# EAGLE design SmartMDC03 (EAGLE 7.5.0)
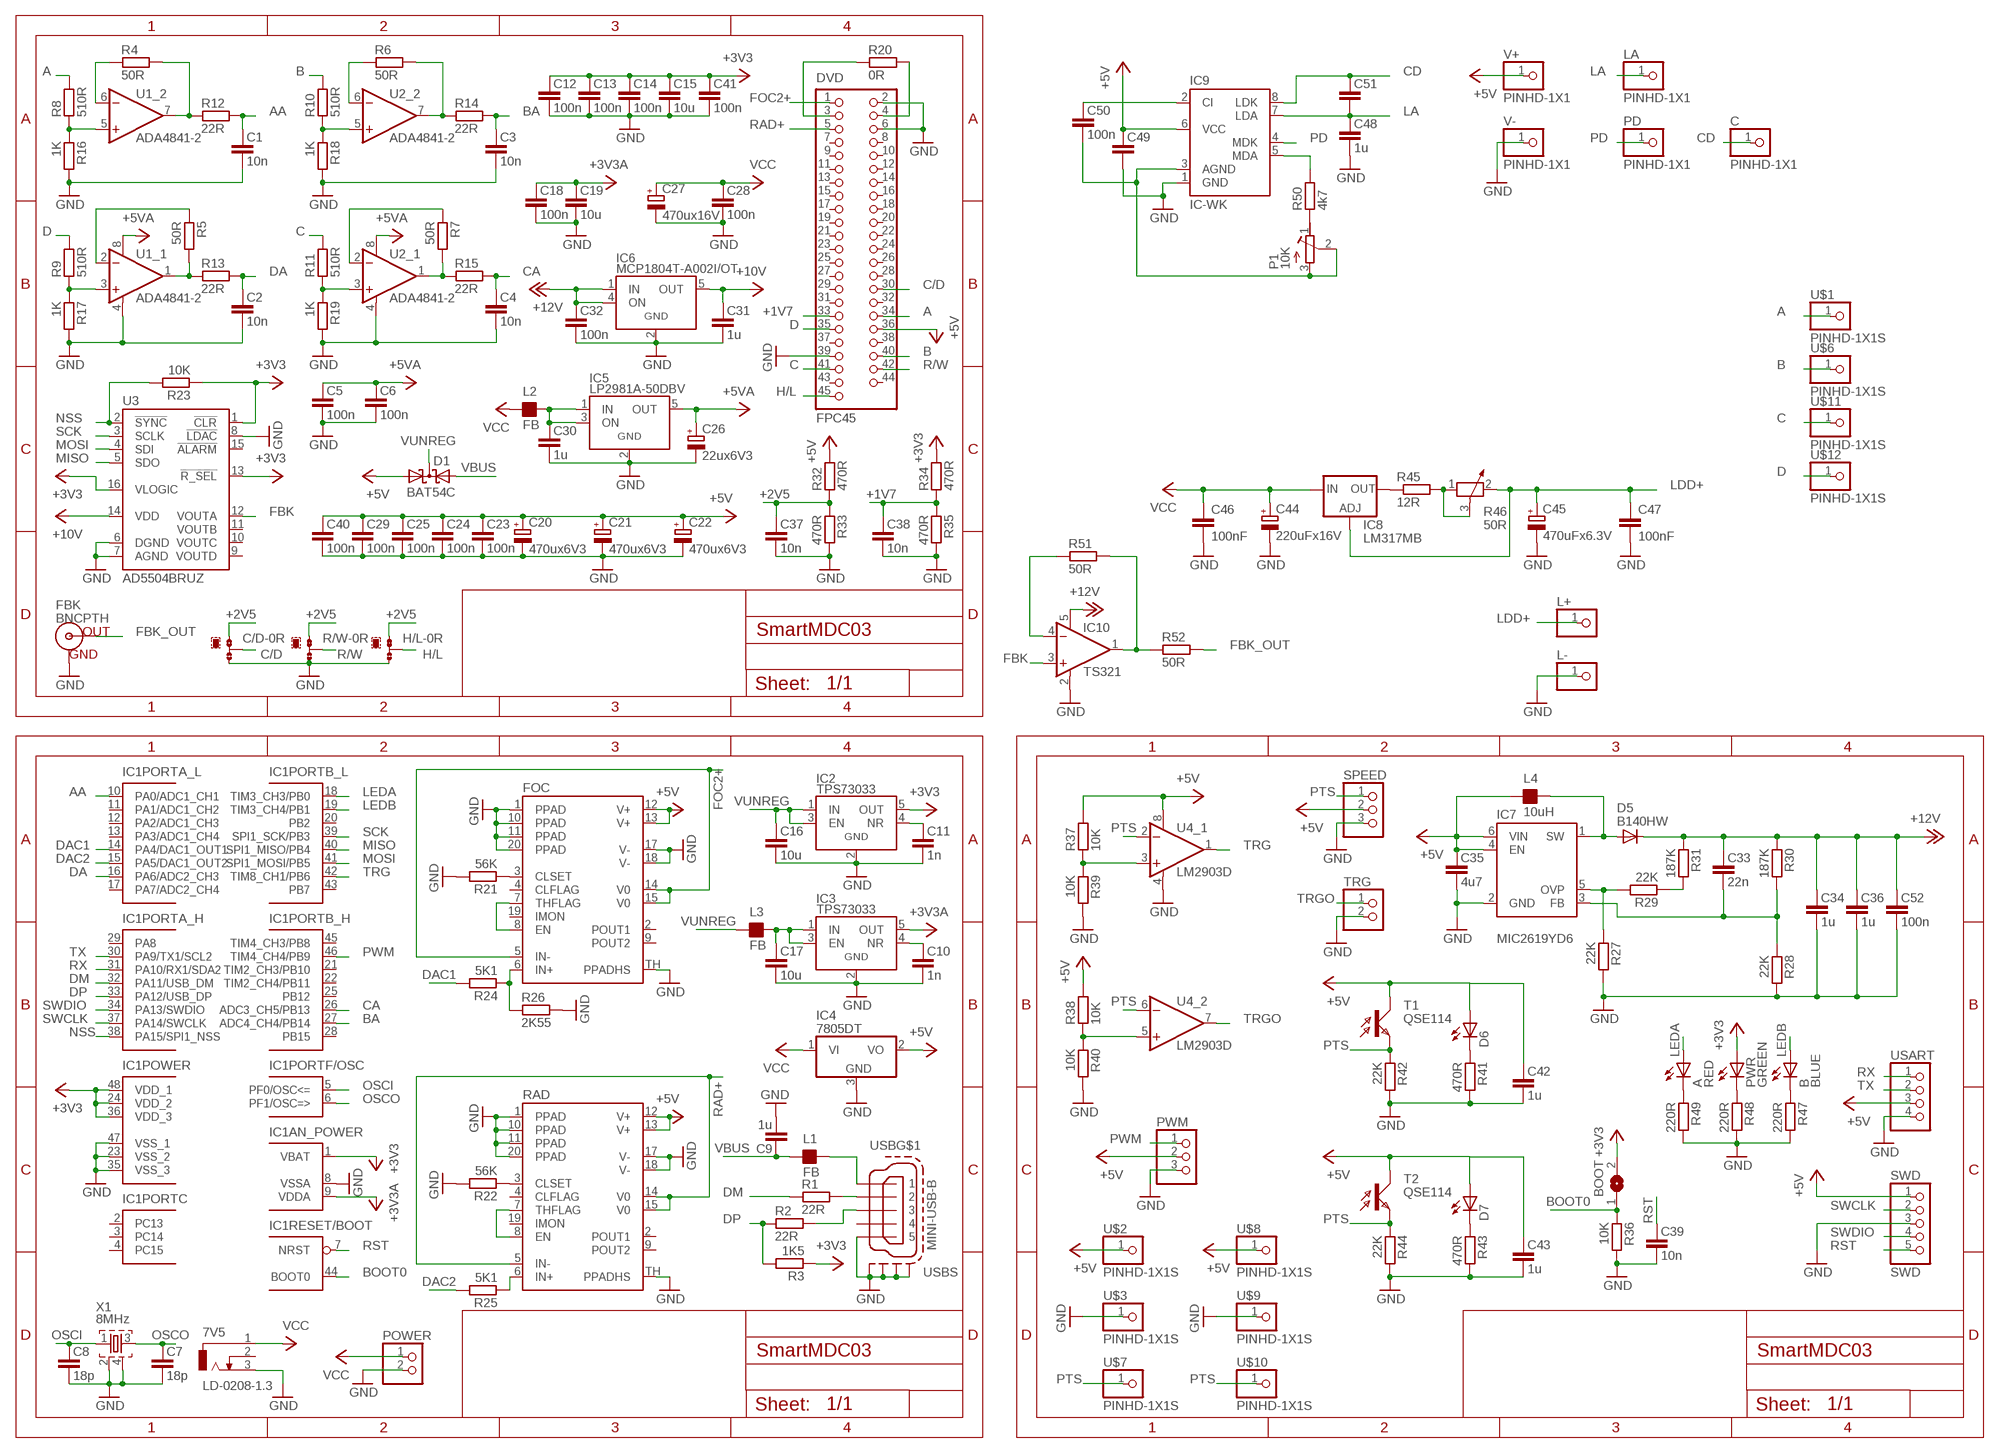
[diagram p0: schematic, sheet 1]

## Parts
7V5  LD-0208-1.3  [LD-0208]
A  RED  LEDCHIPLED_0805  [CHIPLED_0805]
B  BLUE  LEDCHIPLED_0805  [CHIPLED_0805]
BOOT  SJ  [SJ]
C  PINHD-1X1  [1X01]
C1  10n  C_EU_C0603G  [C0603G]
C2  10n  C_EU_C0603G  [C0603G]
C3  10n  C_EU_C0603G  [C0603G]
C4  10n  C_EU_C0603G  [C0603G]
C5  100n  C_EU_C0603G  [C0603G]
C6  100n  C_EU_C0603G  [C0603G]
C7  18p  C_EU_C0603G  [C0603G]
C8  18p  C_EU_C0603G  [C0603G]
C9  1u  C_EU_C0603G  [C0603G]
C10  1n  C_EU_C0603G  [C0603G]
C11  1n  C_EU_C0603G  [C0603G]
C12  100n  C_EU_C0603G  [C0603G]
C13  100n  C_EU_C0603G  [C0603G]
C14  100n  C_EU_C0603G  [C0603G]
C15  10u  C_EU_C0805G  [C0805G]
C16  10u  C_EU_C0805G  [C0805G]
C17  10u  C_EU_C0805G  [C0805G]
C18  100n  C_EU_C0603G  [C0603G]
C19  10u  C_EU_C0805G  [C0805G]
C20  470ux6V3  CPOL-EUSMCD  [SMC_D]
C21  470ux6V3  CPOL-EUSMCD  [SMC_D]
C22  470ux6V3  CPOL-EUSMCD  [SMC_D]
C23  100n  C_EU_C0603G  [C0603G]
C24  100n  C_EU_C0603G  [C0603G]
C25  100n  C_EU_C0603G  [C0603G]
C26  22ux6V3  CPOL-EUSMCA  [SMC_A]
C27  470ux16V  CPOL-EUE2.5-7  [E2,5-7]
C28  100n  C_EU_C0603G  [C0603G]
C29  100n  C_EU_C0603G  [C0603G]
C30  1u  C_EU_C0603G  [C0603G]
C31  1u  C_EU_C0603G  [C0603G]
C32  100n  C_EU_C0603G  [C0603G]
C33  22n  C_EU_C0603  [C0603]
C34  1u  C_EU_C0603G  [C0603G]
C35  4u7  C_EU_C0603G  [C0603G]
C36  1u  C_EU_C0603G  [C0603G]
C37  10n  C_EU_C0603G  [C0603G]
C38  10n  C_EU_C0603G  [C0603G]
C39  10n  C_EU_C0603G  [C0603G]
C40  100n  C_EU_C0603G  [C0603G]
C41  100n  C_EU_C0603G  [C0603G]
C42  1u  C_EU_C0603G  [C0603G]
C43  1u  C_EU_C0603G  [C0603G]
C44  220uFx16V  CPOL-EUE3.5-8  [E3,5-8]
C45  470uFx6.3V  CPOL-EUE3.5-8  [E3,5-8]
C46  100nF  C-EU050-024X044  [C050-024X044]
C47  100nF  C-EU050-024X044  [C050-024X044]
C48  1u  C_EU_C0805  [C0805]
C49  C_EU_C0805  [C0805]
C50  100n  C_EU_C0805  [C0805]
C51  C_EU_C0805  [C0805]
C52  100n  C_EU_C0603G  [C0603G]
C/D  0R-JUMPA  [A0R-JMP]
D1  BAT54C  [SOT23]
D5  B140HW  [SOD123]
D6  OP240  [OP240]
D7  OP240  [OP240]
DVD  FPC45  CON-FPC45  [FPC45]
FBK  BNCPTH  [BNC]
FOC  OPA569  [SO-20]
H/L  0R-JUMPA  [A0R-JMP]
IC1  STM32F303CXT6  [LQFP48]
IC2  TPS73033  TPS769XX  [SOT23-5]
IC3  TPS73033  TPS769XX  [SOT23-5]
IC4  7805DT  [TO252]
IC5  LP2981A-50DBV  [SOT23-5]
IC6  MCP1804T-A002I/OT  [SOT23-5]
IC7  MIC2619YD6  [SOT23-6]
IC8  LM317MB  [TO220L1]
IC9  IC-WK  [SOIC-8]
IC10  TS321  [SOT23-5]
L1  FB  FB_0603  [L0603]
L2  FB  FB_0603  [L0603]
L3  FB  FB_0603  [L0603]
L4  10uH  FB_1210  [L1210]
L+  PINHD-1X1  [1X01]
L-  PINHD-1X1  [1X01]
LA  PINHD-1X1  [1X01]
P1  10K  R-TRIMM3165W  [RTRIM3165W]
PD  PINHD-1X1  [1X01]
POWER  PINHD-1X2  [1X02]
PWM  PINHD-1X3  [1X03]
PWR  GREEN  LEDCHIPLED_0805  [CHIPLED_0805]
R1  22R  R_EU_R0603  [R0603]
R2  22R  R_EU_R0603  [R0603]
R3  1K5  R_EU_R0603  [R0603]
R4  50R  R_EU_R0603  [R0603]
R5  50R  R_EU_R0603  [R0603]
R6  50R  R_EU_R0603  [R0603]
R7  50R  R_EU_R0603  [R0603]
R8  510R  R_EU_R0603  [R0603]
R9  510R  R_EU_R0603  [R0603]
R10  510R  R_EU_R0603  [R0603]
R11  510R  R_EU_R0603  [R0603]
R12  22R  R_EU_R0603  [R0603]
R13  22R  R_EU_R0603  [R0603]
R14  22R  R_EU_R0603  [R0603]
R15  22R  R_EU_R0603  [R0603]
R16  1K  R_EU_R0603G  [R0603G]
R17  1K  R_EU_R0603G  [R0603G]
R18  1K  R_EU_R0603G  [R0603G]
R19  1K  R_EU_R0603G  [R0603G]
R20  0R  R_EU_R0603  [R0603]
R21  56K  R_EU_R0603G  [R0603G]
R22  56K  R_EU_R0603G  [R0603G]
R23  10K  R_EU_R0603  [R0603]
R24  5K1  R_EU_R0603  [R0603]
R25  5K1  R_EU_R0603  [R0603]
R26  2K55  R_EU_R0603G  [R0603G]
R27  22K  R_EU_R0603G  [R0603G]
R28  22K  R_EU_R0603G  [R0603G]
R29  22K  R_EU_R0603  [R0603]
R30  187K  R_EU_R0603  [R0603]
R31  187K  R_EU_R0603  [R0603]
R32  470R  R_EU_R0603  [R0603]
R33  470R  R_EU_R0603G  [R0603G]
R34  470R  R_EU_R0603  [R0603]
R35  470R  R_EU_R0603G  [R0603G]
R36  10K  R_EU_R0603G  [R0603G]
R37  10K  R_EU_R0603  [R0603]
R38  10K  R_EU_R0603  [R0603]
R39  10K  R_EU_R0603G  [R0603G]
R40  10K  R_EU_R0603G  [R0603G]
R41  470R  R_EU_R0603G  [R0603G]
R42  22K  R_EU_R0603G  [R0603G]
R43  470R  R_EU_R0603G  [R0603G]
R44  22K  R_EU_R0603G  [R0603G]
R45  12R  R-EU_0207/7  [0207/7]
R46  50R  POTENTIOMETER_PT_SPIN  [PT-SPIN]
R47  220R  R_EU_R0603G  [R0603G]
R48  220R  R_EU_R0603G  [R0603G]
R49  220R  R_EU_R0603G  [R0603G]
R50  4k7  R_EU_R0805  [R0805]
R51  50R  R_EU_R0603  [R0603]
R52  50R  R_EU_R0603  [R0603]
R/W  0R-JUMPA  [A0R-JMP]
RAD  OPA569  [SO-20]
SPEED  PINHD-1X3  [1X03]
SWD  SWD  PINHD-1X5  [1X05]
T1  QSE114  [QSE114]
T2  QSE114  [QSE114]
TRG  PINHD-1X2  [1X02]
U1  ADA4841-2  [SOIC-8]
U2  ADA4841-2  [SOIC-8]
U3  AD5504BRUZ  [TSSOP16]
U4  LM2903D  [SOIC-8]
U$1  PINHD-1X1S  [1X01S]
U$2  PINHD-1X1S  [1X01S]
U$3  PINHD-1X1S  [1X01S]
U$6  PINHD-1X1S  [1X01S]
U$7  PINHD-1X1S  [1X01S]
U$8  PINHD-1X1S  [1X01S]
U$9  PINHD-1X1S  [1X01S]
U$10  PINHD-1X1S  [1X01S]
U$11  PINHD-1X1S  [1X01S]
U$12  PINHD-1X1S  [1X01S]
USART  PINHD-1X4  [1X04]
USB  MINI-USB-B  MINI-USB-SCHIELD-32005-201  [32005-201]
V+  PINHD-1X1  [1X01]
V-  PINHD-1X1  [1X01]
X1  8MHz  ABMM2  [ABMM2]

## Nets
+1V7: C38.1 DVD.33 R34.1 R35.1
+2V5: C37.1 C/D.1 H/L.1 R32.1 R33.1 R/W.1
+3V3: BOOT.2 C12.1 C13.1 C14.1 C15.1 C41.1 IC1.1(AN_POWER:VBAT) IC1.24(POWER:VDD_2) IC1.36(POWER:VDD_3) IC1.48(POWER:VDD_1) IC2.5(OUT) PWR.A R3.1 R23.1 R34.2 U3.1(!CLR) U3.13(!R_SEL) U3.16(VLOGIC)
+3V3A: C18.1 C19.1 IC1.9(AN_POWER:VDDA) IC3.5(OUT)
+5V: C20.+ C21.+ C22.+ C23.1 C24.1 C25.1 C29.1 C35.1 C40.1 C42.1 C43.1 C49.1 D1.1(A1) D6.A D7.A DVD.36 FOC.12(V+) FOC.13(V+) IC4.2(VO) IC7.4(EN) IC7.6(VIN) IC9.6(VCC) L4.1 PWM.2 R32.2 R37.2 R38.2 RAD.12(V+) RAD.13(V+) SPEED.2 SWD.1 T1.C T2.C U4.8(_1:V+) U$2.1 U$8.1 USART.3 V+.1
+5VA: C5.1 C6.1 C26.+ IC5.5(OUT) U1.8(_1:V+) U2.8(_1:V+)
+10V: C31.1 IC6.5(OUT) U3.14(VDD)
+12V: C32.1 C33.1 C34.1 C36.1 C52.1 D5.C IC6.1(IN) IC6.4(ON) IC10.5(V+) R30.1 R31.1
A: DVD.34 R8.2 U$1.1
AA: C1.1 IC1.10(PORTA_L:PA0/ADC1_CH1) R12.2
B: DVD.40 R10.2 U$6.1
BA: C3.1 IC1.27(PORTB_H:ADC4_CH4/PB14) R14.2
BOOT0: BOOT.1 IC1.44(RESET/BOOT:BOOT0) R36.1
C: DVD.41 R11.2 U$11.1
C/D: C/D.2 DVD.30
CA: C4.1 IC1.26(PORTB_H:ADC3_CH5/PB13) R15.2
CD: C51.1 C.1 IC9.8(LDK)
D: DVD.35 R9.2 U$12.1
DA: C2.1 IC1.16(PORTA_L:PA6/ADC2_CH3) R13.2
DAC1: IC1.14(PORTA_L:PA4/DAC1_OUT1) R24.2
DAC2: IC1.15(PORTA_L:PA5/DAC1_OUT2) R25.2
DM: IC1.32(PORTA_H:PA11/USB_DM) R1.1
DP: IC1.33(PORTA_H:PA12/USB_DP) R2.1 R3.2
FBK: IC10.3(+IN) U3.12(VOUTA)
FBK_OUT: FBK.S(OUT) R52.2
FOC2+: DVD.1 FOC.5(IN-) FOC.14(V0) FOC.15(V0)
GND: 7V5.3 C1.2 C2.2 C3.2 C4.2 C5.2 C6.2 C7.2 C8.2 C9.2 C10.2 C11.2 C12.2 C13.2 C14.2 C15.2 C16.2 C17.2 C18.2 C19.2 C20.- C21.- C22.- C23.2 C24.2 C25.2 C26.- C27.- C28.2 C29.2 C30.2 C31.2 C32.2 C34.2 C35.2 C36.2 C37.2 C38.2 C39.2 C40.2 C41.2 C42.2 C43.2 C44.- C45.- C46.2 C47.2 C48.2 C49.2 C52.2 C/D.3 DVD.2 DVD.6 DVD.39 FBK.GND FOC.1(PPAD) FOC.10(PPAD) FOC.11(PPAD) FOC.17(V-) FOC.18(V-) FOC.20(PPAD) FOC.TH(PPADHS) H/L.3 IC1.8(AN_POWER:VSSA) IC1.23(POWER:VSS_2) IC1.35(POWER:VSS_3) IC1.47(POWER:VSS_1) IC2.2(GND) IC3.2(GND) IC4.3(GND) IC5.2(GND) IC6.2(GND) IC7.2(GND) IC9.1(GND) IC10.2(V-) L-.1 POWER.2 PWM.3 R16.2 R17.2 R18.2 R19.2 R21.2 R22.2 R26.2 R27.2 R28.2 R33.2 R35.2 R36.2 R39.2 R40.2 R41.2 R42.2 R43.2 R44.2 R47.2 R48.2 R49.2 R/W.3 RAD.1(PPAD) RAD.10(PPAD) RAD.11(PPAD) RAD.17(V-) RAD.18(V-) RAD.20(PPAD) RAD.TH(PPADHS) SPEED.3 SWD.3 TRG.2 U1.4(_1:V-) U2.4(_1:V-) U3.6(DGND) U3.7(AGND) U3.8(!LDAC) U4.4(_1:V-) U$3.1 U$9.1 USART.4 USB.5 USB.M1(S:S1) USB.M2(S:S2) USB.M3(S:S3) USB.M4(S:S4) V-.1 X1.2 X1.4
H/L: DVD.45 H/L.2
LA: C48.1 C51.2 IC9.7(LDA) LA.1
LDD+: C45.+ C47.1 IC8.1(ADJ) L+.1 R46.2
LEDA: A.A IC1.18(PORTB_L:TIM3_CH3/PB0)
LEDB: B.A IC1.19(PORTB_L:TIM3_CH4/PB1)
MISO: IC1.40(PORTB_L:SPI1_MISO/PB4) U3.5(SDO)
MOSI: IC1.41(PORTB_L:SPI1_MOSI/PB5) U3.4(SDI)
N$1: C11.1 IC2.4(NR)
N$2: R9.1 R17.1 U1.3(_1:+IN)
N$3: R11.1 R19.1 U2.3(_1:+IN)
N$4: R10.1 R18.1 U2.5(_2:+IN)
N$5: R4.2 R12.1 U1.7(_2:OUT)
N$6: R5.2 R13.1 U1.1(_1:OUT)
N$7: R6.2 R14.1 U2.7(_2:OUT)
N$8: R7.2 R15.1 U2.1(_1:OUT)
N$9: D7.C R43.1
N$10: R25.1 RAD.6(IN+)
N$11: FOC.6(IN+) R24.1 R26.1
N$12: C10.1 IC3.4(NR)
N$13: R4.1 U1.6(_2:-IN)
N$14: R6.1 U2.6(_2:-IN)
N$15: R7.1 U2.2(_1:-IN)
N$16: R5.1 U1.2(_1:-IN)
N$17: R8.1 R16.1 U1.5(_2:+IN)
N$18: D6.C R41.1
N$19: C30.1 IC5.1(IN) IC5.3(ON) L2.2
N$20: R1.2 USB.2
N$21: R2.2 USB.3
N$22: C17.1 IC3.1(IN) IC3.3(EN) L3.2
N$23: DVD.4 R20.2
N$24: DVD.3 R20.1
N$25: L1.2 USB.1
N$26: IC8.2(OUT) R45.1
N$27: R45.2 R46.1 R46.3
N$28: R37.1 R39.1 U4.3(_1:+IN)
N$29: B.C R47.1
N$30: FOC.3(CLSET) R21.1
N$31: R22.1 RAD.3(CLSET)
N$32: R38.1 R40.1 U4.5(_2:+IN)
N$33: FOC.7(THFLAG) FOC.8(EN)
N$34: R29.1 R31.2
N$35: RAD.7(THFLAG) RAD.8(EN)
N$36: IC7.5(OVP) R27.1 R29.2
N$37: C33.2 IC7.3(FB) R28.1 R30.2
N$38: PWR.C R48.1
N$39: A.C R49.1
N$40: P1.1(A) R50.1
N$41: IC10.4(-IN) R51.1
N$42: C50.1 IC9.2(CI)
N$43: IC10.1(OUT) R51.2 R52.1
N$44: IC9.5(MDA) R50.2
N$45: C50.2 IC9.3(AGND) P1.2(S) P1.3(E)
NSS: IC1.38(PORTA_H:PA15/SPI1_NSS) R23.2 U3.2(!SYNC)
OSCI: C8.1 IC1.5(PORTF/OSC:PF0/OSC<=) X1.1
OSCO: C7.1 IC1.6(PORTF/OSC:PF1/OSC=>) X1.3
PD: IC9.4(MDK) PD.1
PTS: R42.1 R44.1 SPEED.1 T1.E T2.E U4.2(_1:-IN) U4.6(_2:-IN) U$7.1 U$10.1
PWM: IC1.46(PORTB_H:TIM4_CH4/PB9) PWM.1
R/W: DVD.42 R/W.2
RAD+: DVD.5 RAD.5(IN-) RAD.14(V0) RAD.15(V0)
RST: C39.1 IC1.7(RESET/BOOT:NRST) SWD.5
RX: IC1.31(PORTA_H:PA10/RX1/SDA2) USART.1
SCK: IC1.39(PORTB_L:SPI1_SCK/PB3) U3.3(SCLK)
SW: D5.A IC7.1(SW) L4.2
SWCLK: IC1.37(PORTA_H:PA14/SWCLK) SWD.2
SWDIO: IC1.34(PORTA_H:PA13/SWDIO) SWD.4
TRG: IC1.42(PORTB_L:TIM8_CH1/PB6) U4.1(_1:OUT)
TRGO: TRG.1 U4.7(_2:OUT)
TX: IC1.30(PORTA_H:PA9/TX1/SCL2) USART.2
VBUS: C9.1 D1.2(A2) L1.1
VCC: 7V5.1 C27.+ C28.1 C44.+ C46.1 IC4.1(VI) IC8.3(IN) L2.1 POWER.1
VUNREG: C16.1 D1.3(CC) IC2.1(IN) IC2.3(EN) L3.1
Unconnected: 7V5.2 DVD.7 DVD.8 DVD.9 DVD.10 DVD.11 DVD.12 DVD.13 DVD.14 DVD.15 DVD.16 DVD.17 DVD.18 DVD.19 DVD.20 DVD.21 DVD.22 DVD.23 DVD.24 DVD.25 DVD.26 DVD.27 DVD.28 DVD.29 DVD.31 DVD.32 DVD.37 DVD.38 DVD.43 DVD.44 FOC.2(POUT1) FOC.4(CLFLAG) FOC.9(POUT2) FOC.19(IMON) IC1.2(PORTC:PC13) IC1.3(PORTC:PC14) IC1.4(PORTC:PC15) IC1.11(PORTA_L:PA1/ADC1_CH2) IC1.12(PORTA_L:PA2/ADC1_CH3) IC1.13(PORTA_L:PA3/ADC1_CH4) IC1.17(PORTA_L:PA7/ADC2_CH4) IC1.20(PORTB_L:PB2) IC1.21(PORTB_H:TIM2_CH3/PB10) IC1.22(PORTB_H:TIM2_CH4/PB11) IC1.25(PORTB_H:PB12) IC1.28(PORTB_H:PB15) IC1.29(PORTA_H:PA8) IC1.43(PORTB_L:PB7) IC1.45(PORTB_H:TIM4_CH3/PB8) RAD.2(POUT1) RAD.4(CLFLAG) RAD.9(POUT2) RAD.19(IMON) U3.9(VOUTD) U3.10(VOUTC) U3.11(VOUTB) U3.15(!ALARM) USB.4

## Library data of the parts
7V5 = SmartMDC:LD-0208: Straight PCB Mount DC Power Socket 1A, 12 V dc, Nickel Plated
A B PWR = SmartMDC:LED
BOOT = SmartMDC:SJ: SMD solder JUMPER
C LA PD U$1-U$3 U$6-U$12 V+ V- = SmartMDC:PINHD-1X1
C1-C14 C18 C23-C25 C28-C43 C48-C52 = SmartMDC:C_EU_
C15-C17 C19 = svBGC:C_EU_
C20-C22 C26 C27 = SmartMDC:CPOL-EU: POLARIZED CAPACITOR, European symbol
C44 C45 = rcl:CPOL-EU: POLARIZED CAPACITOR, European symbol
C46 C47 = rcl:C-EU: CAPACITOR, European symbol
C/D H/L R/W = jump-0r-smd:0R-JUMP: SMD 0R 0805 Jumper
D1 = SmartMDC:BAT54C: Schottky Diodes Source: Fairchild .. BAT54.pdf
D5 = SmartMDC:B140HW: 1.0A SURFACE MOUNT SCHOTTKY BARRIER RECTIFIER
D6 D7 = SmartMDC:OP240: GaAlAs Plastic Infrared Emitting Diode
DVD = SmartMDC:CON-FPC
FBK = SmartMDC:BNC: BNC Connector, Mouser Part# 5227161
FOC RAD = SmartMDC:OPA569: Burr Brown products from Texas Instruments Rail-to-Rail I/O, 2A POWER AMPLIFIER
IC1 = SmartMDC:STM32F303CXT6: ST STM32F101/103 48pin LQFP
IC2 IC3 = SmartMDC:TPS769XX: Texas Instruments LDO Regulator
IC4 = linear:78*: Positive VOLTAGE REGULATOR Source: http://cache.national.com/ds/LM/LM78L05.pdf http://www.fairchildsemi.com/ds/LM/LM7805.pdf
IC5 = SmartMDC:LP2981A: TEXAS INSTRUMENTS 100-mA ULTRA-LOW DROPOUT REGULATOR WITH SHUTDOWN
IC6 = SmartMDC:MCP1804T
IC7 = SmartMDC:MIC2619
IC8 = v-reg:LM317?*: 500 mA Adjustable Output Positive Voltage Regulator Source: http://www.onsemi.co.jp .. LM317M-D.PDF
IC9 = SmartMDC:IC-WK
IC10 = SmartMDC:TS321
L1-L4 = SmartMDC:FB_: FERRITE BEAD
L+ L- = pinhead:PINHD-1X1: PIN HEADER
P1 = SmartMDC:R-TRIMM
POWER TRG = SmartMDC:PINHD-1X2: PIN HEADER
PWM SPEED = SmartMDC:PINHD-1X3: PIN HEADER
R1-R44 R47-R52 = SmartMDC:R_EU_
R45 = rcl:R-EU_: RESISTOR, European symbol
R46 = rcl:POTENTIOMETER_: Potentiometer
SWD = SmartMDC:PINHD-1X5: PIN HEADER
T1 T2 = SmartMDC:QSE114: PLASTIC SILICON INFRARED PHOTOTRANSISTOR
U1 U2 = SmartMDC:ADA4841
U3 = SmartMDC:AD5504: ANALOG DEVICES High Voltage, Quad-Channel 12-Bit Voltage Output DAC
U4 = SmartMDC:LM2903: COMPARATOR
USART = SmartMDC:PINHD-1X4: PIN HEADER
USB = SmartMDC:MINI-USB-SCHIELD-: MINI USB-B Conector Source: www.cypressindustries.com; OC_FARNELL: unknown; OC_NEWARK: unknown
X1 = SmartMDC:ABM

## Board
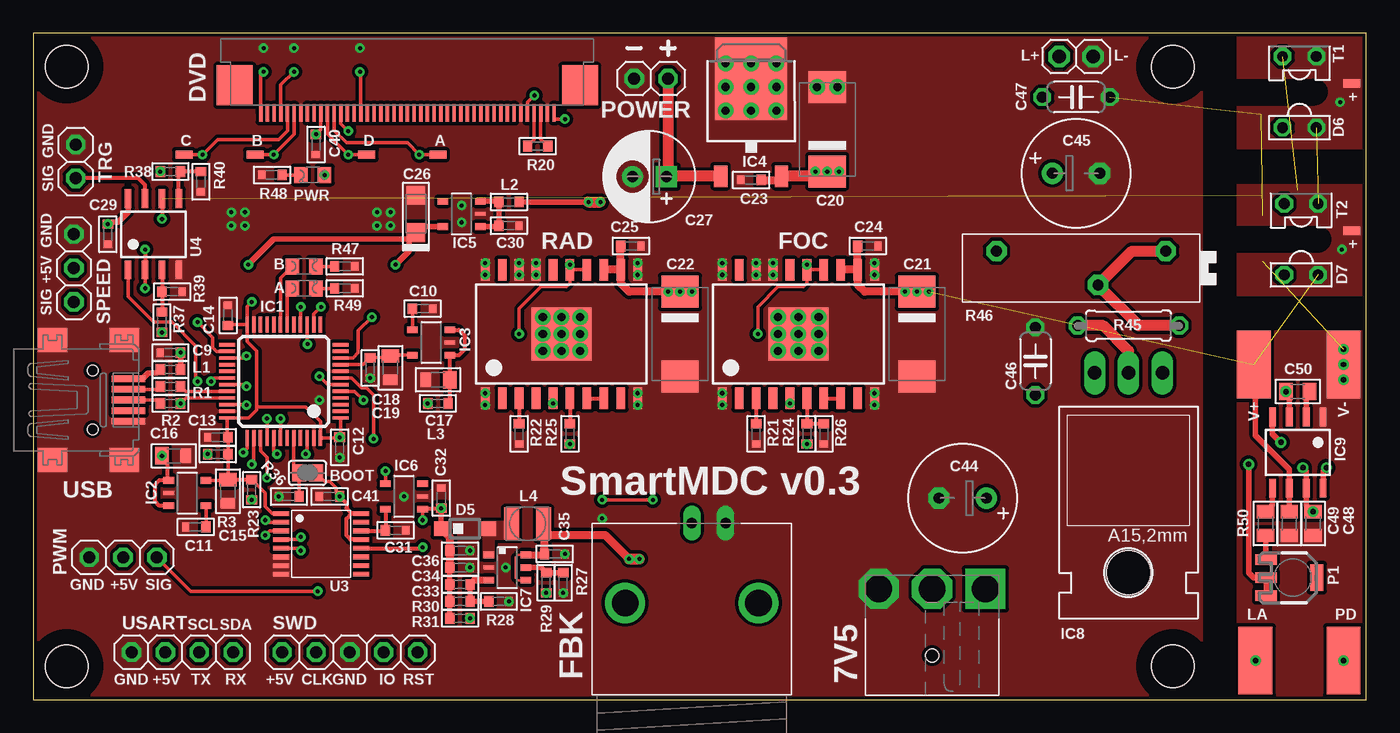
[diagram p1: board, top side]
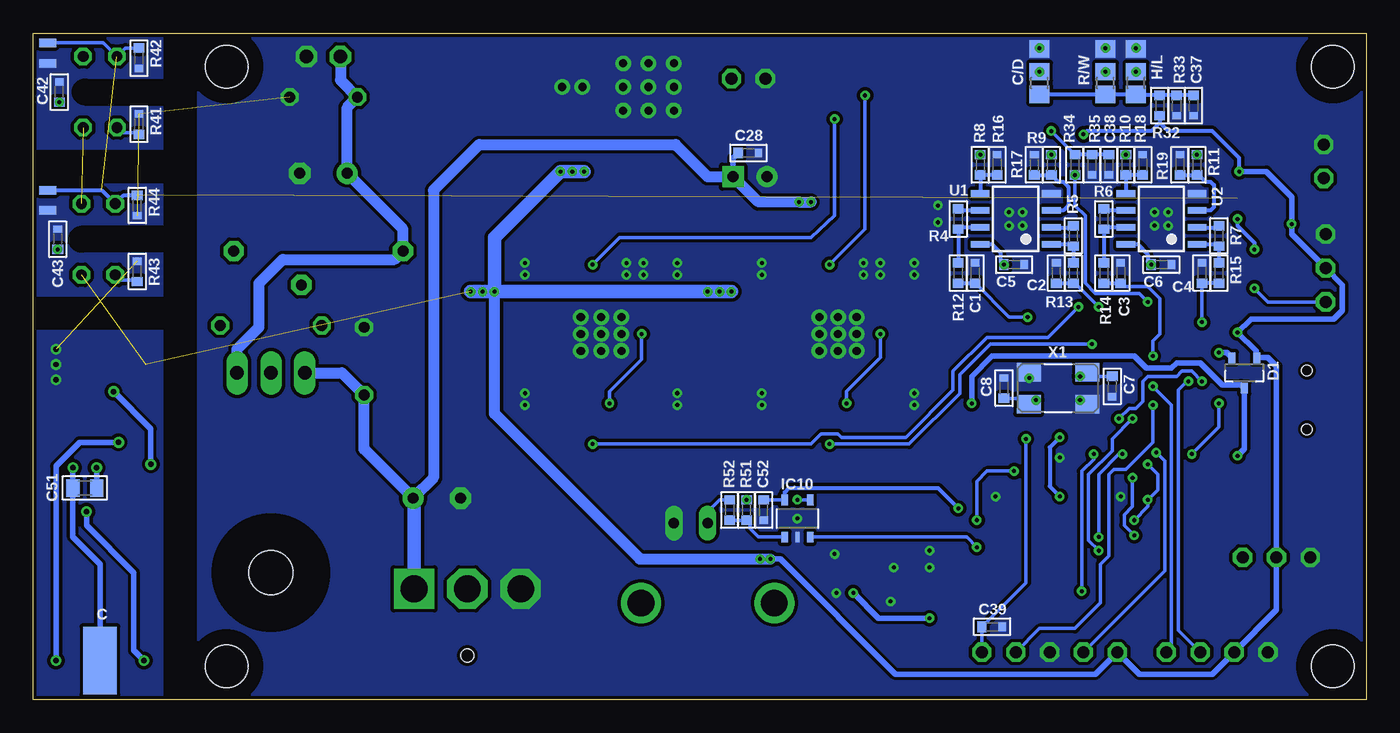
[diagram p2: board, bottom side, seen from below]

Size 100 x 50 mm. Coordinates in mm from the lower left corner, seen from the top.
Outline: 0,0 100,0 100,50 0,50 0,0
Copper layers (1*16): Top 0.035mm / dielectric 1.5mm / Bottom 0.035mm
Design rules "default *": minimum track width 8mil, minimum drill 12mil, track to track 8mil, track to pad 8mil, pad to pad 8mil, via to via 8mil, smd to smd 0mil, copper to edge 10mil, drill to drill 8mil, minimum pad ring 10mil, minimum via ring 8mil, stop-mask expansion 4mil, vias tented up to drill 16mil, thermal gap 10mil
Holes 3.2 mm at 2.5,2.5 2.5,47.5 85.5,47.5 85.5,2.5
tRestrict: area 0,0 to 5,5; area 0,45 to 5,50; area 83,45 to 88,50; area 83,0 to 88,5; area 90,28 to 100,30; area 90,39 to 100,41; 3 lines
bRestrict: area 0,45 to 5,50; area 0,0 to 5,5; area 83,0 to 88,5; area 83,45 to 88,50; area 90,39 to 100,41; area 90,39 to 100,41; area 90,28 to 100,30; 3 lines

### Footprints (pad centres in the part's own frame; a part is rotated, then mirrored left to right if it is on the bottom)
LD-0208 = drill 2 square: 1 4,5 | drill 2 octagon: 2 0,5; 3 -4,5 | hole 1: 0,0
CHIPLED_0805 = smd 1.2 x 1: A 0,-0.889; C 0,0.889
SJ = smd 1.067 x 1.27: 1 -0.635,0; 2 0.635,0
1X01 = smd 2.54 x 5.08: 1 0,0
C0603G = smd 0.7 x 0.8: 1 -0.762,0 | smd 0.548 x 0.648: 2 0.762,0
C0805G = smd 1 x 1.3: 1 -0.889,0 | smd 0.797 x 1.097: 2 0.889,0
SMC_D = smd 2.4 x 2.8: + -3.175,0; - 3.175,0
SMC_A = smd 1.4 x 1.4: + -1.4,0; - 1.4,0
E2,5-7 = drill 0.813 pad 1.6 square: + -1.27,0 | drill 0.813 pad 1.6: - 1.27,0
C0603 = smd 0.7 x 0.8: 1 -0.762,0; 2 0.762,0
E3,5-8 = drill 0.813 pad 1.6: + -1.778,0 | drill 0.813 pad 1.6 octagon: - 1.778,0
C050-024X044 = drill 0.813 octagon: 1 -2.54,0; 2 2.54,0
C0805 = smd 1 x 1.3: 1 -0.889,0; 2 0.889,0
A0R-JMP = smd 1.5 x 1.3: 1 0,1.7; 2 0,0; 3 0,-1.7
SOT23 = smd 0.55 x 0.8: 1 -0.94,-1.143; 2 0.94,-1.143; 3 0,1.143
SOD123 = smd 1.1 x 1.1: A 1.778,0; C -1.778,0
OP240 = drill 0.813 octagon: A 0,-1.27; C 0,1.27
FPC45 = smd 0.25 x 1.3: 1 -11,3.1; 2 -10.5,3.1; 3 -10,3.1; 4 -9.5,3.1; 5 -9,3.1; 6 -8.5,3.1; 7 -8,3.1; 8 -7.5,3.1; 9 -7,3.1; 10 -6.5,3.1; 11 -6,3.1; 12 -5.5,3.1; 13 -5,3.1; 14 -4.5,3.1; 15 -4,3.1; 16 -3.5,3.1; 17 -3,3.1; 18 -2.5,3.1; 19 -2,3.1; 20 -1.5,3.1; 21 -1,3.1; 22 -0.5,3.1; 23 0,3.1; 24 0.5,3.1; 25 1,3.1; 26 1.5,3.1; 27 2,3.1; 28 2.5,3.1; 29 3,3.1; 30 3.5,3.1; 31 4,3.1; 32 4.5,3.1; 33 5,3.1; 34 5.5,3.1; 35 6,3.1; 36 6.5,3.1; 37 7,3.1; 38 7.5,3.1; 39 8,3.1; 40 8.5,3.1; 41 9,3.1; 42 9.5,3.1; 43 10,3.1; 44 10.5,3.1; 45 11,3.1 | smd 2.7 x 3: S$1 -12.95,1.02; S$2 12.95,1.02
BNC = drill 2: 3 -5,0; 4 5,0 | drill 0.8 long: GND -2.54,-6; S 0,-6
SO-20 = smd 0.65 x 1.6: 1 -5.715,-4.826; 2 -4.445,-4.826; 3 -3.175,-4.826; 4 -1.905,-4.826; 5 -0.635,-4.826; 6 0.635,-4.826; 7 1.905,-4.826; 8 3.175,-4.826; 9 4.445,-4.826; 10 5.715,-4.826; 11 5.715,4.826; 12 4.445,4.826; 13 3.175,4.826; 14 1.905,4.826; 15 0.635,4.826; 16 -0.635,4.826; 17 -1.905,4.826; 18 -3.175,4.826; 19 -4.445,4.826; 20 -5.715,4.826 | smd 4.5 x 4: TH 0,0
LQFP48 = smd 0.25 x 1.2: 1 -2.75,-4.25; 2 -2.25,-4.25; 3 -1.75,-4.25; 4 -1.25,-4.25; 5 -0.75,-4.25; 6 -0.25,-4.25; 7 0.25,-4.25; 8 0.75,-4.25; 9 1.25,-4.25; 10 1.75,-4.25; 11 2.25,-4.25; 12 2.75,-4.25; 25 2.75,4.25; 26 2.25,4.25; 27 1.75,4.25; 28 1.25,4.25; 29 0.75,4.25; 30 0.25,4.25; 31 -0.25,4.25; 32 -0.75,4.25; 33 -1.25,4.25; 34 -1.75,4.25; 35 -2.25,4.25; 36 -2.75,4.25 | smd 1.2 x 0.25: 13 4.25,-2.75; 14 4.25,-2.25; 15 4.25,-1.75; 16 4.25,-1.25; 17 4.25,-0.75; 18 4.25,-0.25; 19 4.25,0.25; 20 4.25,0.75; 21 4.25,1.25; 22 4.25,1.75; 23 4.25,2.25; 24 4.25,2.75; 37 -4.25,2.75; 38 -4.25,2.25; 39 -4.25,1.75; 40 -4.25,1.25; 41 -4.25,0.75; 42 -4.25,0.25; 43 -4.25,-0.25; 44 -4.25,-0.75; 45 -4.25,-1.25; 46 -4.25,-1.75; 47 -4.25,-2.25; 48 -4.25,-2.75
SOT23-5 = smd 0.5 x 0.8: 1 -0.95,-1.397; 3 0.95,-1.397; 4 0.95,1.397; 5 -0.95,1.397 | smd 0.297 x 0.8: 2 0,-1.397
TO252 = smd 1 x 1.6: 1 -2.28,-4.8; 2 2.28,-4.8 | smd 5.4 x 6.2: 3 0,2.5
SOT23-6 = smd 0.5 x 0.8: 1 -0.95,-1.397; 3 0.95,-1.397; 4 0.95,1.397; 5 0,1.397; 6 -0.95,1.397 | smd 0.297 x 0.8: 2 0,-1.397
TO220L1 = drill 1.016 long: 1 -2.54,-3.81; 2 0,-3.81; 3 2.54,-3.81 | hole 3.302: 0,11.176
SOIC-8 = smd 0.5 x 1.4: 1 -1.905,-2.667; 2 -0.635,-2.667; 3 0.635,-2.667; 4 1.905,-2.667; 5 1.905,2.667; 6 0.635,2.667; 7 -0.635,2.667; 8 -1.905,2.667
L0603 = smd 0.7 x 0.8: 1 -0.762,0; 2 0.762,0
L1210 = smd 1.1 x 2.4: 1 -1.2,0; 2 1.2,0
1X01' = drill 1.016 octagon: 1 0,0
RTRIM3165W = smd 0.8 x 1.6: 1 -1.35,-2; 2 0,-2; 3 1.35,-2 | smd 2 x 1: 4 0,1.8
1X02 = drill 0.9 octagon: 1 -1.27,0; 2 1.27,0
1X03 = drill 0.9 octagon: 1 -2.54,0; 2 0,0; 3 2.54,0
R0603 = smd 0.7 x 0.8: 1 -0.762,0; 2 0.762,0
R0603G = smd 0.7 x 0.8: 1 -0.762,0 | smd 0.548 x 0.648: 2 0.762,0
0207/7 = drill 0.813 octagon: 1 -3.81,0; 2 3.81,0
PT-SPIN = drill 0.813 pad 1.524 octagon: 1 -6.35,-1.27; 2 6.35,-1.27; 3 -1.27,1.27
R0805 = smd 1 x 1.3: 1 -0.889,0; 2 0.889,0
1X05 = drill 0.9 octagon: 1 -5.08,0; 2 -2.54,0; 3 0,0; 4 2.54,0; 5 5.08,0
QSE114 = drill 0.813 octagon: C 0,-1.27; E 0,1.27
TSSOP16 = smd 0.35 x 1.2: 1 -2.275,-3; 2 -1.625,-3; 3 -0.975,-3; 4 -0.325,-3; 5 0.325,-3; 6 0.975,-3; 7 1.625,-3; 8 2.275,-3; 9 2.275,3; 10 1.625,3; 11 0.975,3; 12 0.325,3; 13 -0.325,3; 14 -0.975,3; 15 -1.625,3; 16 -2.275,3
1X01S = smd 0.635 x 1.27: 1 0,0
1X04 = drill 0.9 octagon: 1 -3.81,0; 2 -1.27,0; 3 1.27,0; 4 3.81,0
32005-201 = smd 2.5 x 0.5: 1 2.7,1.6; 2 2.7,0.8; 3 2.7,0; 4 2.7,-0.8; 5 2.7,-1.6 | smd 2.2 x 1.8: M1 -3,-4.5; M2 -3,4.5; M3 2.4,4.5; M4 2.4,-4.5 | hole 0.8: 0,2.2; 0,-2.2
ABMM2 = smd 1.8 x 1.4: 1 -2.2,-1.2; 2 2.2,-1.2; 3 2.2,1.2; 4 -2.2,1.2

### Placement (x,y rotation side)
7V5  67.44,3.3 0 top
A  20.32,30.86 270 top
B  20.32,32.51 270 top
BOOT  20.57,17.02 0 top
C  95,2.92 0 bottom
C1  29.34,32 90 bottom
C2  23.24,32 90 bottom
C3  18.41,32 90 bottom
C4  12.32,32 90 bottom
C5  26.42,32.64 0 bottom
C6  15.37,32.64 0 bottom
C7  19.05,23.5 270 bottom
C8  27.18,23.37 90 bottom
C9  10.29,26.04 180 top
C10  29.21,29.34 0 top
C11  12.19,12.95 180 top
C12  22.99,18.92 270 top
C13  13.84,19.68 180 top
C14  14.61,28.83 90 top
C15  14.61,15.62 270 top
C16  10.54,18.29 0 top
C17  30.35,24 180 top
C18  25.27,24.89 270 top
C19  26.8,24.89 270 top
C20  59.56,42.8 90 top
C21  66.29,27.43 270 top
C22  48.51,27.43 270 top
C23  53.85,38.99 180 top
C24  62.61,34.04 0 top
C25  44.83,34.04 0 top
C26  28.7,36.45 90 top
C27  46.23,39.24 180 top
C28  46.35,41.02 0 bottom
C29  5.59,34.92 270 top
C30  35.69,35.56 0 top
C31  27.18,12.7 0 top
C32  30.61,15.11 90 top
C33  32,8.64 0 top
C34  32,9.91 0 top
C35  39.12,10.92 0 top
C36  32,11.18 0 top
C37  12.95,44.58 270 bottom
C38  19.3,40.13 270 bottom
C39  28.07,5.46 0 bottom
C40  21.21,41.66 270 top
C41  22.23,15.24 180 top
C42  98.04,45.59 90 bottom
C43  98.17,34.54 90 bottom
C44  69.72,15.11 180 top
C45  78.23,39.5 0 top
C46  75.18,25.4 90 top
C47  78.23,45.21 0 top
C48  96.01,13.21 270 top
C49  94.23,13.21 270 top
C50  94.87,23.11 180 top
C51  96.14,15.88 0 bottom
C52  45.21,14.22 270 bottom
C/D  24.51,47.12 180 bottom
D1  9.14,24.51 180 bottom
D5  32.38,12.83 0 top
D6  95,42.93 90 top
D7  95.12,31.88 90 top
DVD  28.07,47.12 180 top
FBK  49.4,7.24 180 top
FOC  57.4,27.43 0 top
H/L  17.27,47.12 180 bottom
IC1  18.8,23.88 90 top
IC2  11.56,15.49 270 top
IC3  29.84,26.8 90 top
IC4  53.85,44.07 0 top
IC5  32.13,36.45 90 top
IC6  27.81,15.24 90 top
IC7  35.56,9.91 270 top
IC8  82.17,20.7 180 top
IC9  94.87,18.54 180 top
IC10  42.67,13.59 0 bottom
L1  10.29,24.77 180 top
L2  35.69,37.34 180 top
L3  30.35,22.23 0 top
L4  37.08,13.21 180 top
L+  [1X01']  76.96,48.26 0 top
L-  [1X01']  79.5,48.26 0 top
LA  91.69,2.92 0 top
P1  94.49,9.14 270 top
PD  98.3,2.92 0 top
POWER  46.35,46.61 180 top
PWM  6.73,10.67 180 top
PWR  20.95,39.37 90 top
R1  10.29,23.5 180 top
R2  10.29,22.23 180 top
R3  13.84,18.41 180 top
R4  30.61,36.07 270 bottom
R5  21.97,34.8 270 bottom
R6  19.68,36.07 270 bottom
R7  11.05,34.8 270 bottom
R8  28.96,40.13 90 bottom
R9  23.62,40.13 90 bottom
R10  18.03,40.13 90 bottom
R11  12.7,40.13 90 bottom
R12  30.61,32 270 bottom
R13  21.97,32 270 bottom
R14  19.68,32 270 bottom
R15  11.05,32 270 bottom
R16  27.69,40.13 90 bottom
R17  24.89,40.13 90 bottom
R18  16.76,40.13 90 bottom
R19  13.97,40.13 90 bottom
R20  37.85,41.53 180 top
R21  54.23,19.94 270 top
R22  36.45,19.94 270 top
R23  16.38,15.75 270 top
R24  58.04,19.94 270 top
R25  40.26,19.94 270 top
R26  59.31,19.94 270 top
R27  39.75,8.76 270 top
R28  34.92,7.37 0 top
R29  38.48,8.76 90 top
R30  32,7.37 0 top
R31  32,6.1 0 top
R32  15.49,44.58 270 bottom
R33  14.22,44.58 270 bottom
R34  21.84,40.13 270 bottom
R35  20.57,40.13 270 bottom
R36  19.18,15.24 180 top
R37  9.65,28.32 270 top
R38  10.29,39.62 180 top
R39  10.41,30.61 0 top
R40  12.57,38.86 270 top
R41  92.08,43.18 90 bottom
R42  92.08,48.13 270 bottom
R43  92.2,32.13 90 bottom
R44  92.2,37.08 270 bottom
R45  82.17,28.07 0 top
R46  78.61,32.38 180 top
R47  23.37,32.51 0 top
R48  17.91,39.37 180 top
R49  23.37,30.86 0 top
R50  92.46,13.21 90 top
R51  46.48,14.22 270 bottom
R52  47.75,14.22 90 bottom
R/W  19.56,47.12 180 bottom
RAD  39.62,27.43 0 top
SPEED  3.05,32.38 90 top
SWD  23.75,3.56 0 top
T1  95,48.26 90 top
T2  95.12,37.21 90 top
TRG  3.17,40.39 90 top
U1  26.29,36.07 90 bottom
U2  15.37,36.07 90 bottom
U3  21.59,11.68 270 top
U4  9.02,34.92 0 top
U$1  30.35,40.89 90 top
U$2  98.93,46.23 90 top
U$3  98.93,47.75 270 bottom
U$6  16.64,40.89 90 top
U$7  98.93,49.28 90 bottom
U$8  98.93,35.18 90 top
U$9  98.93,36.7 270 bottom
U$10  98.93,38.23 270 bottom
U$11  11.3,40.89 90 top
U$12  25.02,40.89 90 top
USART  11.18,3.56 180 top
USB  4.45,22.48 0 top
V+  91.57,25.15 0 top
V-  98.3,25.15 0 top
X1  23.11,23.37 0 bottom

### Tracks (layer width: path | path; a pad name or v marks a point on that pad's centre or on a via)
+1V7  (via drill 0.3)
  Top 0.254: DVD.33 23.07,43.23 v23.62,42.67
  Bottom 0.254: v23.62,42.67 R34.1
  Bottom 0.305: C38.1 R35.1 R34.1
+2V5
  Bottom 0.305: C/D.1 R/W.1 H/L.1 17.19,45.34 R32.1 R33.1 C37.1
+3V3  (via drill 0.3)
  Top 0.254: IC1.24 16.05,26.88 16.76,26.16 16.76,21.97 | 16.76,21.97 20.45,21.97 21.55,20.87 IC1.48 22.93,19.63 C12.1 23.05,19.74 IC1.1 | IC1.24 14.66,28.13 C14.1 | IC2.5 14.54,16.44 C15.1 R3.1 C13.1 14.55,19.74 IC1.36 16.17,21.13 16.76,21.72 16.76,21.97 | IC1.24 16.05,29.51 v16.38,29.84 | BOOT.2 21.84,16.38 22.23,16.38 22.73,15.88 22.73,15.49 C41.1 | U3.1 17.92,13.96 17.4,14.48 17.4,15.49 R23.1
  Top 0.305: C15.1 R23.1 | U3.13 23.8,12.01 23.5,12.32 23.5,13.57 23.89,13.96 | C41.1 23.5,14.73 23.5,14.35 23.89,13.96 | U3.16 23.89,13.96
  Bottom 0.254: PWR.A 21.84,37.08 21.08,36.32 21.08,31.24 20.32,30.48 17.02,30.48 v16.38,29.84
  Bottom 0.305: C41.1 23.75,16 23.75,18.92 C12.1
  other vias: 22.99,19.68 22.99,15.24 21.84,39.37
+3V3A
  Top 0.254: IC1.9 24.75,25.13 C18.1 26.67,25.65 C19.1 26.86,25.85 IC3.5
+5V  (via drill 0.3)  (3 unrouted)
  Top 0.203: IC7.6 36.38,10.86 36.2,10.67 36.2,9.14 36.38,8.96 IC7.4
  Top 0.254: DVD.36 21.57,42.78 C40.1
  Top 0.406: 38.29,10.86 C35.1 | U4.8 7.11,36.58 6.35,35.81 5.71,35.81 C29.1 | C49.1 IC9.6 94.23,17.27 91.69,19.81 91.69,25.02 V+.1
  Top 0.508: IC7.6 38.29,10.86
  Top 0.61: FOC.12 FOC.13 | RAD.12 RAD.13 | RAD.12 C25.1 | FOC.12 C24.1 | C23.1 56.13,38.99 IC4.2 | C21.+ v65.41,30.61 62.36,30.61 61.85,31.11 FOC.12 | C22.+ 44.7,30.61 44.07,31.24 RAD.12 | L4.1 38.35,13.14 38.35,12.32 | C35.1 38.35,12.32 | v44.7,10.54 42.93,12.32 38.35,12.32
  Top 0.813: v58.67,39.62 58.32,39.27 IC4.2 | v44.7,10.54 v45.47,10.54
  Bottom 0.305: R38.2 9.53,40.64 11.56,42.67 14.86,42.67 15.49,43.31 | R32.2 15.49,43.31 | 15.49,43.31 16.13,42.67 20.95,42.67 C40.1
  Bottom 0.406: R38.2 7.49,39.62 5.59,37.72 C29.1 5.59,34.92 SPEED.2 1.78,31.11 1.78,29.21 2.41,28.57 8.64,28.57 R37.2 8.26,26.16 8.26,25.78 8.2,25.73 D1.1 7.37,25.65 6.73,25.02 PWM.2 6.73,6.73 USART.3 11.56,1.91 17.02,1.91 SWD.1 20.32,1.91 35.31,1.91 43.94,10.54 v44.7,10.54
  Bottom 0.813: v65.41,30.61 65.41,21.46 54.48,10.54 v44.7,10.54
  Bottom 1.016: v58.67,39.62 C20.+ v60.45,39.62 65.41,34.67 v65.41,30.61 | v65.41,30.61 C21.+ v67.18,30.61 | v47.62,30.61 C22.+ v49.4,30.61 v65.41,30.61
  other vias: 59.56,39.62 66.29,30.61 5.59,35.69 9.65,27.56 9.53,39.62 21.21,42.42 98.04,44.83 98.17,33.78 48.51,30.61
  pour Top (isolate 0.254, rank 6, no thermals): 90,30 90,50 100,50 100,30
+5VA  (via drill 0.3)
  Top 0.406: IC5.5 29.15,35.5 C26.+ 28.7,34.92 28.19,34.42 | 28.19,34.42 28.19,33.66 C5.1 | C6.1 18.03,34.54 28.07,34.54 28.19,34.42
  Bottom 0.305: U2.8 17.14,34.16 16.38,33.4 16.38,32.89 C6.1 | U1.8 28.07,34.16 27.43,33.53 27.43,32.89 C5.1
  other vias: 16.13,32.64 27.18,32.64
+10V
  Top 0.305: IC6.5 C31.1 26.38,12.66 U3.14
+12V  (via drill 0.3)
  Top 0.254: IC6.4 v26.42,17.14 | v29.21,13.46 IC6.1
  Top 0.305: C32.1 30.55,14.29 IC6.1
  Top 0.406: C34.1 C33.1 R30.1 R31.1 | D5.C C32.1
  Top 0.61: D5.C 31.24,12.19 C36.1 C34.1
  Bottom 0.254: v26.42,17.14 28.45,17.14 29.21,16.38 v29.21,13.46 | C52.1 IC10.5
  Bottom 0.305: IC10.5 43.62,15.56 43.31,15.88 32.13,15.88 C32.1
  other vias: 30.61,14.35
A  (via drill 0.3)
  Top 0.254: DVD.34 22.57,42.71 23.5,41.78 28.07,41.78 R8.2 U$1.1
  other vias: 28.96,40.89
AA  (via drill 0.3)
  Top 0.254: IC1.10 23.98,25.63 24.38,26.04 24.38,27.69 v25.4,28.7
  Bottom 0.254: v25.4,28.7 26.8,28.7 C1.1
  Bottom 0.305: R12.2 C1.1
B  (via drill 0.3)
  Top 0.254: DVD.40 19.57,42.43 R10.2 U$6.1
  other vias: 18.03,40.89
BA  (via drill 0.3)
  Top 0.254: IC1.27 15.85,25.63 v16,25.78
  Bottom 0.254: v16,25.78 16,26.92 15.49,27.43 15.49,30.1 16.38,30.99 18.16,30.99 C3.1
  Bottom 0.305: R14.2 C3.1
BOOT0
  Top 0.254: IC1.44 19.55,17.41 BOOT.1 R36.1
C  (via drill 0.3)
  Top 0.254: DVD.41 19.07,42.69 18.41,42.04 13.84,42.04 R11.2 U$11.1
  other vias: 12.7,40.89
C/D  (via drill 0.3)
  Top 0.254: DVD.30 24.57,47.06 C/D.2
  other vias: 24.51,47.12
CA  (via drill 0.3)
  Top 0.254: IC1.26 13.75,26.13 13.46,26.42 13.46,27.18 v12.32,28.32
  Bottom 0.254: v12.32,28.32 C4.1
  Bottom 0.305: R15.2 C4.1
CD  (via drill 0.41)
  Top 0.406: IC9.8 96.77,17.14 v97.03,17.4
  Bottom 0.406: v97.03,17.4 C51.1 97.03,12.19 95,10.16 C.1
D  (via drill 0.3)
  Top 0.254: DVD.35 22.07,42.45 R9.2 U$12.1
  other vias: 23.62,40.89
DA  (via drill 0.3)
  Top 0.254: IC1.16 20.05,29.44 v20.07,29.46
  Bottom 0.254: v20.07,29.46 21.84,31.24 R13.2
  Bottom 0.305: C2.1 R13.2
DAC1  (via drill 0.3)
  Top 0.254: v21.59,29.46 21.05,28.92 IC1.14
  Bottom 0.254: v21.59,29.46 23.88,27.18 28.45,27.18 30.99,24.64 30.99,23.24 34.54,19.68 39.37,19.68 39.62,19.94 40.89,19.94 41.66,19.18 R24.2
  other vias: 58.04,19.18
DAC2  (via drill 0.3)
  Top 0.254: v20.57,26.67 20.55,26.7 IC1.15
  Bottom 0.254: v20.57,26.67 28.19,26.67 30.48,24.38 30.48,22.99 34.29,19.18 R25.2
  other vias: 40.26,19.18
DM
  Top 0.254: IC1.32 11.42,23.13 R1.1
DP  (via drill 0.3)
  Top 0.254: IC1.33 11.45,22.63 R2.1
  Bottom 0.254: R2.1 11.05,20.45 R3.2
  other vias: 11.05,22.23 13.08,18.41
FBK  (via drill 0.3)
  Top 0.305: U3.12 29.14,11.36 v29.21,11.43
  Bottom 0.254: v29.21,11.43 29.97,12.19 IC10.3
FBK_OUT
  Bottom 0.254: R52.2 48.51,14.99 49.4,14.1 FBK.S
FOC2+  (via drill 0.3)
  Top 0.254: FOC.14 FOC.15 | FOC.15 58.04,31.24 57.78,30.99 55.88,30.99 54.36,29.46 v54.36,27.43 | FOC.5 v56.77,22.23 | DVD.1 39.07,43.56 v39.88,43.56 | v58.04,32.64 FOC.15
  Bottom 0.254: v54.36,27.43 54.36,25.53 56.77,23.11 v56.77,22.23 | v39.88,43.56 39.88,36.32 41.66,34.67 56.01,34.67 v58.04,32.64
GND  (via drill 0.3, 0.41, 0.61)  (3 unrouted)
  other vias: 57.4,27.43 39.62,27.43 38.23,26.16 38.23,27.43 38.23,28.7 39.62,26.16 39.62,28.7 41.02,26.16 41.02,27.43 41.02,28.7 55.88,26.16 55.88,27.43 55.88,28.7 57.4,26.16 57.4,28.7 58.93,26.16 58.93,27.43 58.93,28.7 55.75,44.2 53.85,44.2 51.94,44.2 55.75,45.97 55.75,47.75 53.85,45.97 51.94,45.97 53.85,47.75 51.94,47.75 27.81,15.24 32.77,9.91 35.43,9.91 39.75,8 39.88,10.92 35.69,7.37 32.77,11.18 17.27,48.9 19.56,48.9 24.51,48.9 14.86,36.58 15.88,36.58 14.86,35.56 15.88,35.56 25.78,36.58 26.8,36.58 25.78,35.56 26.8,35.56 32.13,37.08 32.13,35.81 58.8,45.97 60.33,45.97 22.99,18.16 25.27,24.13 21.46,22.48 33.91,32.77 33.91,31.88 36.45,32.77 36.45,31.88 37.72,32.77 37.72,31.88 45.34,32.77 45.34,31.88 51.69,32.77 51.69,31.88 54.23,32.77 55.5,32.77 55.5,31.88 54.23,31.88 63.12,32.77 63.12,31.88 51.69,22.99 51.69,22.1 63.12,22.99 63.12,22.1 45.34,22.99 45.34,22.1 33.91,22.1 33.91,22.99 18.41,15.24 98.3,25.15 98.3,26.29 98.3,24 42.67,13.59
  pour Top (isolate 0.254, rank 6, no thermals): 0,0 0,50 88,50 88,0
  pour Bottom (isolate 0.254, rank 6, no thermals): 0,0 0,50 88,50 88,0
  pour Bottom (isolate 0.254, rank 6, no thermals): 90,0 90,50 100,50 100,0
  pour Top (isolate 0.254, rank 6, no thermals): 90,0 90,28 100,28 100,0
H/L  (via drill 0.3)
  Top 0.254: DVD.45 17.07,46.91 H/L.2
  other vias: 17.27,47.12
LA  (via drill 0.41)
  Top 0.406: C48.1 95.5,14.61 IC9.7 95.5,17.14 v95.25,17.4
  Bottom 0.406: v95.25,17.4 C51.2 | C48.1 96.01,13.08 92.46,9.53 92.46,3.68 LA.1
  other vias: 96.01,14.1 91.69,2.92
LDD+
  Bottom 0.813: L+.1 76.96,46.48 C47.1 76.45,44.45 C45.+ 72.26,35.31 R46.2 72.9,33.02 81.28,33.02 83.06,31.24 83.06,27.94 84.71,26.29 IC8.1
LEDA
  Top 0.254: IC1.18 19.05,30.48 A.A
LEDB
  Top 0.254: IC1.19 18.55,31.63 B.A
MISO  (via drill 0.3)
  Top 0.254: v20.07,11.18 19.88,11.36 U3.5 | IC1.40 17.55,21.06 v17.53,21.08
  Bottom 0.254: v17.53,21.08 19.05,19.56 19.05,18.67 20.83,16.89 20.83,11.94 v20.07,11.18
MOSI  (via drill 0.3)
  Top 0.254: IC1.41 18.05,18.66 v18.29,18.41 | U3.4 19.88,12.01 v20.07,12.19
  Bottom 0.254: v20.07,12.19 20.07,16.89 18.54,18.41 v18.29,18.41
N$1
  Top 0.254: C11.1 IC2.4
N$2
  Bottom 0.305: U1.3 22.73,36.7 22.35,37.08 22.35,38.48 22.73,38.86 23.11,38.86 R9.1 R17.1
N$3
  Bottom 0.305: R19.1 R11.1 12.57,39.37 12.06,38.86 11.68,38.86 11.43,38.61 11.43,36.96 11.68,36.7 U2.3
N$4
  Bottom 0.305: R18.1 R10.1 U2.5
N$5
  Bottom 0.305: U1.7 30.48,35.43 R4.2 R12.1
N$6
  Bottom 0.305: U1.1 22.1,34.16 R5.2 R13.1
N$7
  Bottom 0.305: U2.7 19.56,35.43 R6.2 R14.1
N$8
  Bottom 0.305: R15.1 R7.2 11.18,34.16 U2.1
N$9
  Bottom 0.254: D7.C 93.47,31.5 92.33,31.5 R43.1
N$10
  Top 0.305: RAD.6 R25.1
N$11
  Top 0.305: FOC.6 R24.1 R26.1
N$12
  Top 0.254: IC3.4 C10.1
N$13
  Bottom 0.305: U1.6 30.48,36.7 R4.1
N$14
  Bottom 0.305: U2.6 19.56,36.7 R6.1
N$15
  Bottom 0.305: U2.2 11.18,35.43 R7.1
N$16
  Bottom 0.305: U1.2 22.1,35.43 R5.1
N$17
  Bottom 0.305: R16.1 R8.1 U1.5
N$18
  Bottom 0.254: R41.1 92.2,42.55 93.34,42.55 D6.C
N$19
  Top 0.406: IC5.3 34.86,37.4 L2.2 C30.1 34.86,35.5 IC5.1
N$20
  Top 0.254: USB.2 9.31,23.28 R1.2
N$21
  Top 0.254: USB.3 9.27,22.48 R2.2
N$22
  Top 0.305: L3.2 31.24,22.35 C17.1 IC3.1 31.94,25.85 32.38,26.29 32.38,27.3 31.94,27.75 IC3.3
N$23
  Top 0.254: DVD.4 37.57,42.01 R20.2
N$24
  Top 0.254: DVD.3 38.07,42.07 R20.1
N$25
  Top 0.406: USB.1 8.2,24.08 8.64,24.51 9.27,24.51 L1.2
N$26
  Top 0.813: IC8.2 82.17,26.16 80.26,28.07 R45.1
N$27
  Top 0.813: R46.1 82.42,33.66 R46.3 82.93,28.07 R45.2
N$28
  Top 0.305: U4.3 R39.1 R37.1
N$29
  Top 0.254: B.C R47.1
N$30
  Top 0.305: FOC.3 R21.1
N$31
  Top 0.305: RAD.3 R22.1
N$32
  Top 0.305: R40.1 R38.1 10.92,39.5 U4.5
N$33
  Top 0.305: FOC.7 FOC.8
N$34  (via drill 0.3)
  Bottom 0.406: R31.2 36.58,6.1 R29.1
  other vias: 32.77,6.1 38.48,8
N$35
  Top 0.305: RAD.7 RAD.8
N$36
  Top 0.406: IC7.5 38.1,9.91 R29.2 R27.1
N$37
  Top 0.406: C33.2 R30.2 R28.1
  Top 0.508: IC7.3 33.09,8.96 C33.2
N$38
  Top 0.254: PWR.C R48.1
N$39
  Top 0.254: A.C R49.1
N$40
  Top 0.406: R50.1 92.46,10.53 P1.1
N$41  (via drill 0.3)
  Top 0.254: v42.67,14.99 R51.1
  Bottom 0.254: IC10.4 v42.67,14.99
  other vias: 46.48,14.99
N$42
  Top 0.406: IC9.2 95.5,22.86 C50.1
N$43
  Bottom 0.254: R52.1 R51.2 46.23,13.21 46.23,12.83 45.59,12.19 IC10.1
N$44
  Top 0.406: IC9.5 92.96,14.61 R50.2
N$45  (via drill 0.41)
  Top 0.406: IC9.3 94.23,22.86 C50.2 | P1.3 P1.2 91.57,9.14 91.19,9.53 v91.19,17.65
  Bottom 0.406: v91.19,17.65 91.19,20.32 C50.2
  other vias: 93.98,23.11
NSS  (via drill 0.3)
  Top 0.254: IC1.38 16.55,17.82 v16.38,17.65 | U3.2 17.55,13.31 v17.4,13.46
  Bottom 0.254: v16.38,17.65 15.62,16.89 15.62,15.75 R23.2 16.38,14.48 v17.4,13.46
  other vias: 16.38,14.99
OSCI  (via drill 0.3)
  Top 0.254: IC1.5 24.12,23.13 v24.77,22.48
  Bottom 0.254: C8.1 25.75,22.61 X1.1 25.08,22.17 v24.77,22.48 25,22.48
OSCO  (via drill 0.3)
  Top 0.254: IC1.6 22.09,23.63 v21.46,24.26
  Bottom 0.254: C7.1 20.6,24.26 X1.3 21.15,24.57 v21.46,24.26
PD  (via drill 0.41)
  Top 0.406: IC9.4 92.96,19.94 v93.6,19.3
  Bottom 0.406: v93.6,19.3 96.52,19.3 98.3,17.53 PD.1
  other vias: 98.3,2.92
PTS  (via drill 0.3)  (2 unrouted)
  Top 0.254: v8.38,30.86 U4.2
  Top 0.305: U4.6 v9.65,36.07 | v8.38,33.78 U4.2
  Bottom 0.254: R42.1 93.09,48.9 T1.E 94.74,49.28 U$7.1 | SPEED.1 7.37,29.84 v8.38,30.86
  Bottom 0.305: v9.65,36.07 9.65,35.56 8.38,34.29 v8.38,33.78 | R44.1 93.22,37.85 T2.E 94.87,38.23 U$10.1
PWM  (via drill 0.3)
  Top 0.254: v21.34,8.13 11.81,8.13 PWM.1 | IC1.46 20.55,18.51 v20.45,18.41
  Bottom 0.254: v20.45,18.41 20.45,18.03 21.34,17.14 v21.34,8.13
R/W  (via drill 0.3)
  Top 0.254: DVD.42 18.57,46.13 R/W.2
  other vias: 19.56,47.12
RAD+  (via drill 0.3)
  Top 0.254: RAD.14 RAD.15 | RAD.15 40.26,31.24 40.01,30.99 38.1,30.99 36.45,29.34 v36.45,27.43 | v38.99,22.23 RAD.5 | DVD.5 37.07,44.81 v37.59,45.34 | v40.26,32.64 RAD.15
  Bottom 0.254: v36.45,27.43 36.45,25.65 38.99,23.11 v38.99,22.23 | v37.59,45.34 37.59,35.31 v40.26,32.64
RST  (via drill 0.3)
  Top 0.254: IC1.7 23.88,24.13 24.64,23.37 25.02,23.37 25.53,22.86 v25.53,19.56
  Bottom 0.254: SWD.5 C39.1 25.53,8.76 v25.53,19.56
RX  (via drill 0.3)
  Top 0.254: IC1.31 15.87,23.63 v16,23.5
  Bottom 0.254: v16,23.5 14.61,22.1 14.61,3.94 USART.1
SCK  (via drill 0.3)
  Top 0.254: IC1.39 17.05,18.64 17.53,18.16 v17.53,16.64 | 17.65,12.57 v17.4,12.32 17.74,12.66 U3.3
  Bottom 0.254: v17.53,16.64 17.53,14.48 18.16,13.84 18.16,13.08 v17.4,12.32
SW
  Top 0.406: L4.2 35.88,12.52 35.81,12.45
  pour Top (isolate 0.254, no thermals): 33.78,13.34 33.78,10.67 34.54,10.67 34.54,12.06 36.32,12.06 36.32,13.34
SWCLK  (via drill 0.3)
  Top 0.254: IC1.37 16.05,18.84 v15.75,18.54
  Bottom 0.254: v15.75,18.54 15.11,17.91 15.11,9.65 SWD.2
SWDIO  (via drill 0.3)
  Top 0.254: IC1.34 15.97,22.13 v16,22.1
  Bottom 0.254: v16,22.1 16,19.3 18.03,17.27 18.92,17.27 19.3,16.89 19.3,10.79 19.94,10.16 19.94,7.24 21.84,5.33 24.51,5.33 SWD.4
TRG  (via drill 0.3)
  Top 0.254: IC1.42 v18.55,21.08 v18.54,21.08 | v12.32,23.88 12.19,24 12.19,26.54 10.41,28.32 9.02,28.32 7.11,30.23 U4.1
  Bottom 0.254: v18.54,21.08 17.78,21.84 17.27,21.84 16.76,22.35 16.76,23.88 16.38,24.26 14.22,24.26 13.84,24.64 13.08,24.64 v12.32,23.88
TRGO
  Top 0.305: U4.7 8.38,38.61 7.87,39.12 TRG.1
TX  (via drill 0.3)
  Top 0.254: IC1.30 13.59,24.13 v13.34,23.88
  Bottom 0.254: v13.34,23.88 13.46,23.88 14.1,23.24 14.1,5.21 USART.2
VBUS  (via drill 0.3)
  Top 0.406: C9.1 L1.1
  Bottom 0.406: D1.2 10.46,26.04 C9.1
  other vias: 11.05,26.04
VCC  (via drill 0.3)
  Top 0.406: L2.1 v41.66,37.34
  Top 0.813: IC4.1 47.52,39.27 C27.+ 47.62,39.37 POWER.1 | v41.66,37.34 v42.55,37.34
  Bottom 0.406: C28.1 47.5,40.64 C27.+
  Bottom 0.813: v41.66,37.34 v42.55,37.34 45.59,37.34 C27.+ 49.4,39.24 51.82,41.66 66.55,41.66 69.98,38.23 69.98,16.64 C44.+ 75.18,18.8 C46.1 76.83,24.51 IC8.3
  Bottom 1.016: 7V5.1 71.44,15.05 C44.+
VUNREG  (via drill 0.3)
  Top 0.254: C16.1 9.65,18.16 10.03,17.78 | 10.03,16.57 IC2.1
  Top 0.305: IC2.3 9.46,14.54 9.14,14.86 9.14,16.13 9.46,16.44 IC2.1 | 10.03,17.78 10.03,16.57
  Bottom 0.406: C16.1 9.14,18.8 D1.3 9.4,23.62 10.79,23.62 12.45,25.27 14.22,25.27 14.61,24.89 16.51,24.89 17.4,25.78 28.07,25.78 29.59,24.26 L3.1
  other vias: 9.65,18.29 29.59,22.23

### Text on the board
tPlace: + | C | B | D | A | GND | SIG | GND | + | +5V | SIG | V+ | V- | SmartMDC v0.3 | GND | +5V | SIG | LA | PD | SCL | SDA | GND | +5V | TX | RX | +5V | CLK | GND | IO | RST
bPlace: C